# EAGLE design logic (EAGLE 6.5.0)
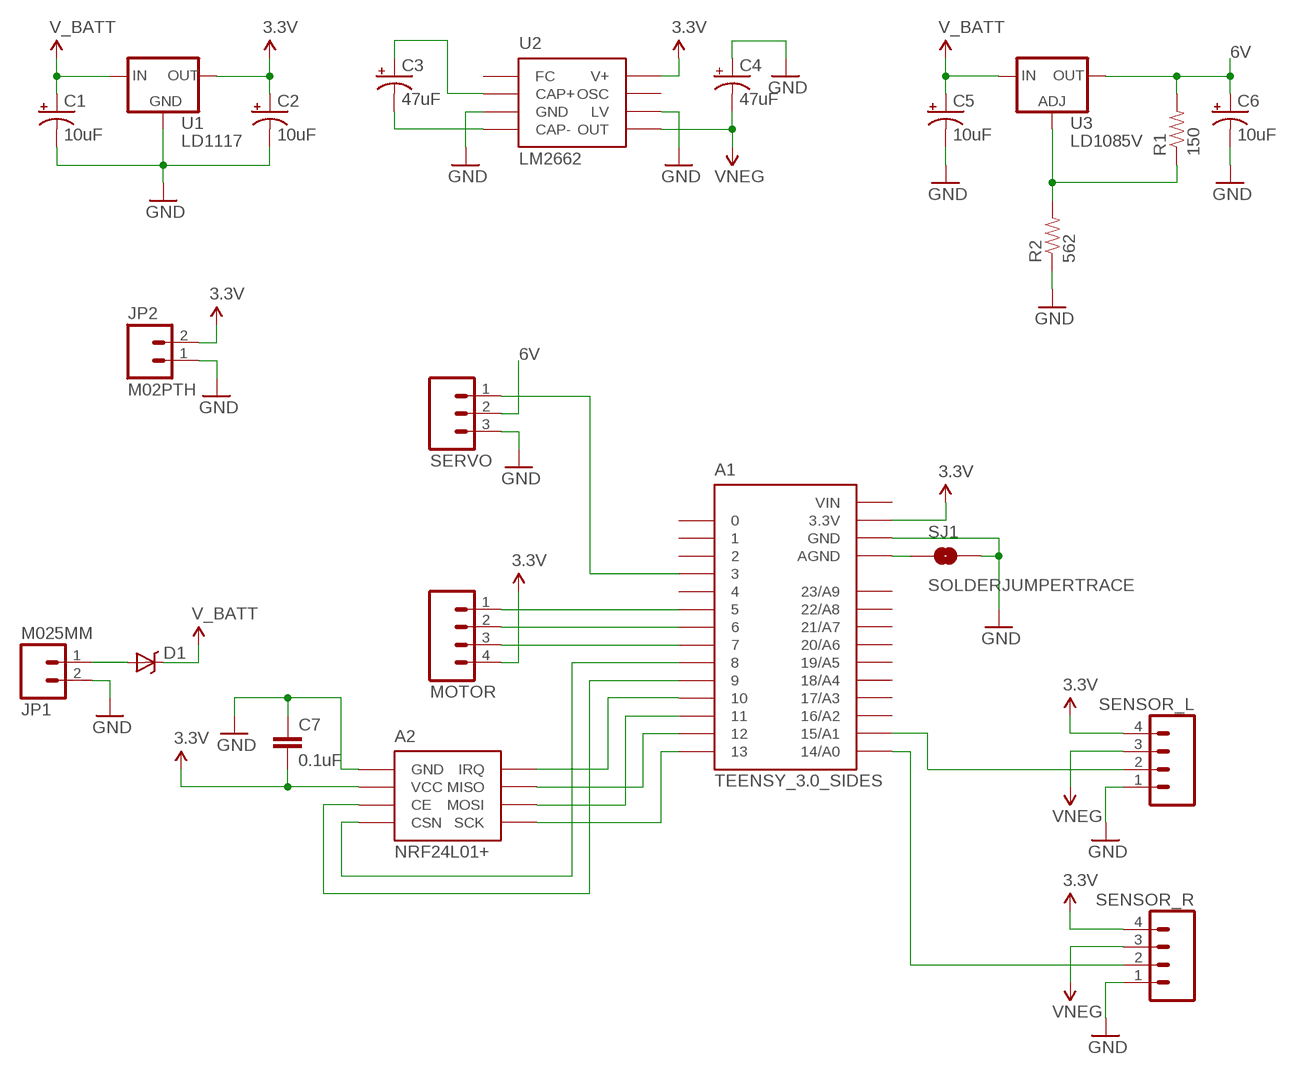
[diagram p0: schematic, sheet 1]

## Parts
A1  TEENSY_3.0_SIDES  [TEENSY_3.0_SIDES]
A2  NRF24L01+  [NRF24L01+]
C1  10uF  CPOL-USE2-4  [E2-4]
C2  10uF  CPOL-USE2-4  [E2-4]
C3  47uF  CAP_POLPTH1  [CPOL-RADIAL-100UF-25V]
C4  47uF  CAP_POLPTH1  [CPOL-RADIAL-100UF-25V]
C5  10uF  CPOL-USE2-4  [E2-4]
C6  10uF  CPOL-USE2-4  [E2-4]
C7  0.1uF  CAP0805  [0805]
D1  DIODE-SCHOTTKY_  [SMA-DIODE]
JP1  M025MM  [SCREWTERMINAL-5MM-2]
JP2  M02PTH  [1X02]
MOTOR  M04POLAR_LOCK  [MOLEX-1X4_LOCK]
R1  150  RESISTOR0805-RES  [0805]
R2  562  RESISTOR0805-RES  [0805]
SENSOR_L  M04POLAR_LOCK  [MOLEX-1X4_LOCK]
SENSOR_R  M04POLAR_LOCK  [MOLEX-1X4_LOCK]
SERVO  M03LOCK_LONGPADS  [1X03_LOCK_LONGPADS]
SJ1  SOLDERJUMPERTRACE  [SJ_2S-TRACE]
U1  LD1117  [SOT-223]
U2  LM2662  [SOIC-8]
U3  LD1085V  LM317TS  [317TS]

## Nets
3.3V: A1.3.3V A2.2(VCC) C2.+ C7.2 JP2.2 MOTOR.4 SENSOR_L.4 SENSOR_R.4 U1.2(OUT) U1.4(OUT) U2.8(V+)
6V: C6.+ R1.2 SERVO.2 U3.2(OUT)
GND: A1.GND A2.1(GND) C1.- C2.- C4.1(+) C5.- C6.- C7.1 JP1.2 JP2.1 R2.1 SENSOR_L.1 SENSOR_R.1 SERVO.3 SJ1.2 U1.1(GND) U2.3(GND) U2.6(LV)
N$1: D1.A JP1.1
N$2: C3.1(+) U2.2(CAP+)
N$3: C3.2(-) U2.4(CAP-)
N$4: R1.1 R2.2 U3.1(ADJ)
N$5: A1.13 A2.5(SCK)
N$6: A1.12 A2.7(MISO)
N$7: A1.11 A2.6(MOSI)
N$8: A1.8 A2.4(CSN)
N$9: A1.10 A2.8(IRQ)
N$10: A1.9 A2.3(CE)
N$11: A1.3 SERVO.1
N$12: A1.AGND SJ1.1
N$13: A1.15/A1 SENSOR_L.2
N$14: A1.14/A0 SENSOR_R.2
N$15: A1.5 MOTOR.1
N$16: A1.6 MOTOR.2
N$17: A1.7 MOTOR.3
V_BATT: C1.+ C5.+ D1.C U1.3(IN) U3.3(IN)
VNEG: C4.2(-) SENSOR_L.3 SENSOR_R.3 U2.5(OUT)
Unconnected: A1.0 A1.1 A1.2 A1.4 A1.16/A2 A1.17/A3 A1.18/A4 A1.19/A5 A1.20/A6 A1.21/A7 A1.22/A8 A1.23/A9 U2.1(FC) U2.7(OSC)

## Power pins joined to a net without a drawn wire
VIN: A1.VIN

## Library data of the parts
A1 = Teensy3.0:TEENSY_3.0_SIDES
A2 = Custom:NRF24L01+: 2.4 GHz Radio Module
C1 C2 C5 C6 = resistor:CPOL-US: POLARIZED CAPACITOR, American symbol
C3 C4 = SparkFun-Capacitors:CAP_POL: Capacitor Polarized These are standard SMD and PTH capacitors. Normally 10uF, 47uF, and 100uF in electrolytic and tantalum varieties. Always verify the external diameter of the through hole cap, it varies with capacity, voltage, and manufacturer. The EIA devices should be standard.
C7 = SparkFun-Capacitors:CAP: Capacitor Standard 0603 ceramic capacitor, and 0.1" leaded capacitor.
D1 = SparkFun-DiscreteSemi:DIODE-SCHOTTKY: Commonly MBRA140.
JP1 JP2 = SparkFun-Connectors:M02: Standard 2-pin 0.1" header. Use with - straight break away headers ( PRT-00116) - right angle break away headers (PRT-00553) - swiss pins (PRT-00743) - machine pins (PRT-00117) - female headers (PRT-00115) Molex polarized connector foot print use with: PRT-08233 with associated crimp pins and housings. 2.54_SCREWTERM for use with PRT-10571. 3.5mm Screw Terminal footprints for PRT-08084 5mm Screw Terminal footprints for use with PRT-08433
MOTOR SENSOR_L SENSOR_R = SparkFun-Connectors:M04: Header 4 Standard 4-pin 0.1" header. Use with straight break away headers (SKU : PRT-00116), right angle break away headers (PRT-00553), swiss pins (PRT-00743), machine pins (PRT-00117), and female headers (PRT-00115). Molex polarized connector foot print use with SKU : PRT-08231 with associated crimp pins and housings. 1MM SMD Version SKU: PRT-10208
R1 R2 = SparkFun-Resistors:RESISTOR: Resistor Basic schematic elements and footprints for 0603, 1206, and PTH resistors.
SERVO = SparkFun-Connectors:M03: Header 3 Standard 3-pin 0.1" header. Use with straight break away headers (SKU : PRT-00116), right angle break away headers (PRT-00553), swiss pins (PRT-00743), machine pins (PRT-00117), and female headers (PRT-00115). Molex polarized connector foot print use with SKU : PRT-08232 with associated crimp pins and housings.
SJ1 = SparkFun-Passives:SOLDERJUMPER: Solder Jumper Standard SMD solder jumper. Used to automate production. Two varients : Normally Open and Normally Closed are the same, but have different paste layers. NC will have a large amount of paste and should jumper during reflow.
U1 = Custom:LD1117: Low-Dropout Voltage Regulator
U2 = Custom:LM2662: Switched Capacitor Voltage Converter
U3 = v-reg:LM317TS: VOLTAGE REGULATOR

## Board
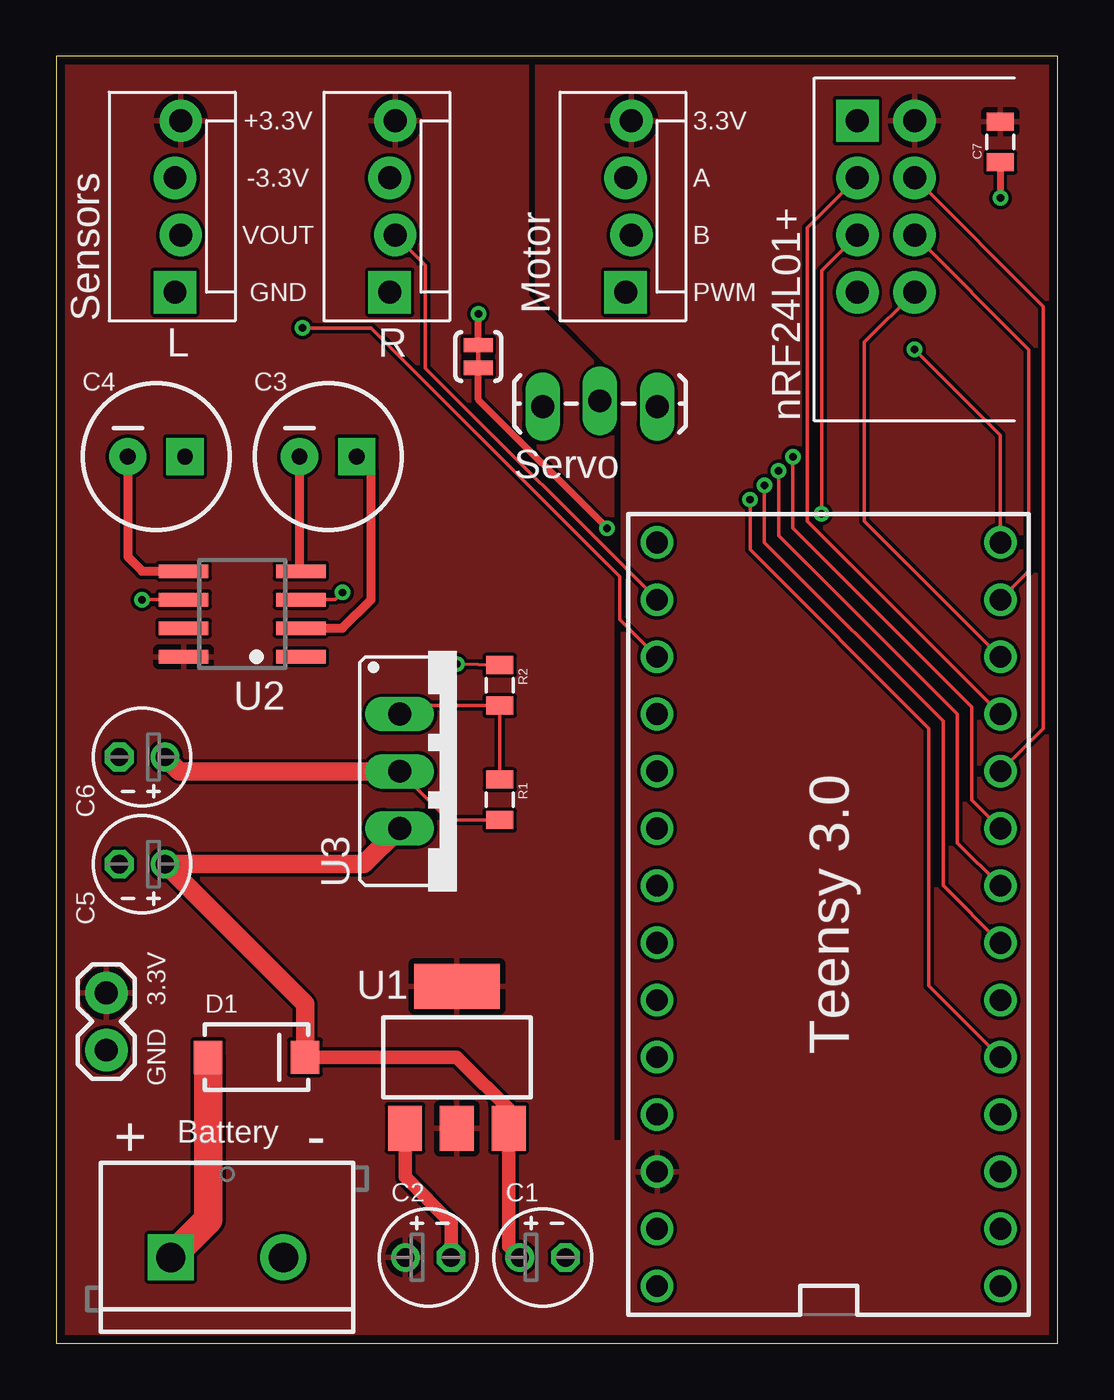
[diagram p1: board, top side]
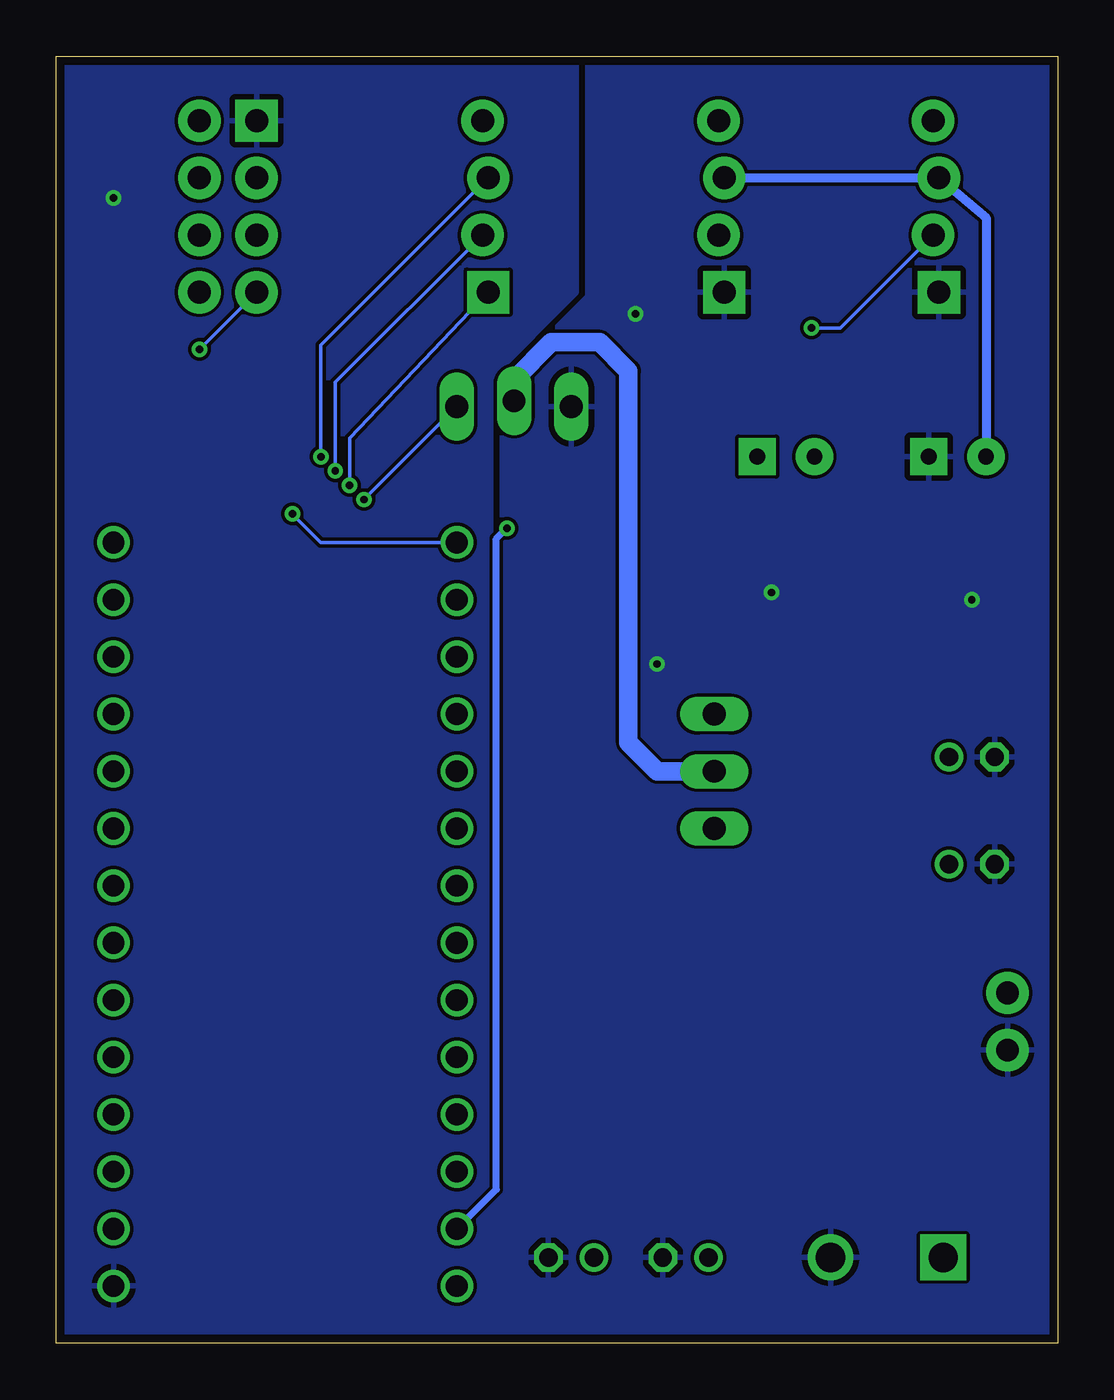
[diagram p2: board, bottom side, seen from below]

Size 44.45 x 57.15 mm. Coordinates in mm from the lower left corner, seen from the top.
Outline: 0,0 44.45,0 44.45,57.15 0,57.15 0,0
Copper layers (1*16): Top 0.0356mm / dielectric 1.5011mm / Bottom 0.0356mm
Design rules "LaenPCBOrder": minimum track width 6mil, minimum drill 13mil, track to track 6mil, track to pad 6mil, pad to pad 6mil, via to via 6mil, smd to smd 6mil, copper to edge 15mil, drill to drill 6mil, minimum pad ring 7mil, minimum via ring 7mil, stop-mask expansion 3mil, vias tented up to drill 0mil, thermal gap 10mil

### Footprints (pad centres in the part's own frame; a part is rotated, then mirrored left to right if it is on the bottom)
TEENSY_3.0_SIDES = drill 0.965: 0 -7.62,13.97; 1 -7.62,11.43; 2 -7.62,8.89; 3 -7.62,6.35; 3.3V 7.62,11.43; 4 -7.62,3.81; 5 -7.62,1.27; 6 -7.62,-1.27; 7 -7.62,-3.81; 8 -7.62,-6.35; 9 -7.62,-8.89; 10 -7.62,-11.43; 11 -7.62,-13.97; 12 -7.62,-16.51; 13 7.62,-16.51; 14/A0 7.62,-13.97; 15/A1 7.62,-11.43; 16/A2 7.62,-8.89; 17/A3 7.62,-6.35; 18/A4 7.62,-3.81; 19/A5 7.62,-1.27; 20/A6 7.62,1.27; 21/A7 7.62,3.81; 22/A8 7.62,6.35; 23/A9 7.62,8.89; AGND 7.62,13.97; GND -7.62,16.51; VIN 7.62,16.51
NRF24L01+ = drill 1.016 pad 1.88 square: 1 -3.81,-1.27 | drill 1.016 pad 1.88: 2 -3.81,1.27; 3 -1.27,-1.27; 4 -1.27,1.27; 5 1.27,-1.27; 6 1.27,1.27; 7 3.81,-1.27; 8 3.81,1.27
E2-4 = drill 0.813 pad 1.27: + -1.016,0 | drill 0.813 pad 1.27 octagon: - 1.016,0
CPOL-RADIAL-100UF-25V = drill 0.7 pad 1.651 square: 1 1.27,0 | drill 0.7 pad 1.651: 2 -1.27,0
0805 = smd 0.8 x 1.2: 1 -0.9,0; 2 0.9,0
SMA-DIODE = smd 1.27 x 1.47: A -2.15,0; C 2.15,0
SCREWTERMINAL-5MM-2 = drill 1.3 pad 2.032 square: 1 0,0 | drill 1.3 pad 2.032: 2 5,0
1X02 = drill 1.016 pad 1.88: 1 0,0; 2 2.54,0
MOLEX-1X4_LOCK = drill 1.016 pad 1.88 square: 1 0,0.127 | drill 1.016 pad 1.88: 2 2.54,-0.127; 3 5.08,0.127; 4 7.62,-0.127
1X03_LOCK_LONGPADS = drill 1.016 long: 1 0,0; 2 2.54,-0.254; 3 5.08,0
SJ_2S-TRACE = smd 0.635 x 1.27: 1 -0.508,0; 2 0.508,0
SOT-223 = smd 1.5 x 2: 1 -2.3,-3.15; 2 0,-3.15; 3 2.3,-3.15 | smd 3.8 x 2: 4 0,3.15
SOIC-8 = smd 0.6 x 2.2: 1 -1.905,-2.6; 2 -0.635,-2.6; 3 0.635,-2.6; 4 1.905,-2.6; 5 1.905,2.6; 6 0.635,2.6; 7 -0.635,2.6; 8 -1.905,2.6
317TS = drill 1.016 long: 1 -2.54,-2.54; 2 0,-2.54; 3 2.54,-2.54

### Placement (x,y rotation side)
A1  34.29,19.05 180 top
A2  36.83,50.48 270 top
C1  21.59,3.81 0 top
C2  16.51,3.81 0 top
C3  12.06,39.37 0 top
C4  4.45,39.37 0 top
C5  3.81,21.27 180 top
C6  3.81,26.04 180 top
C7  41.91,53.34 90 top
D1  8.89,12.7 0 top
JP1  5.08,3.81 0 top
JP2  2.22,13.02 90 top
MOTOR  25.4,46.67 90 top
R1  19.68,24.13 270 top
R2  19.68,29.21 270 top
SENSOR_L  5.4,46.67 90 top
SENSOR_R  14.92,46.67 90 top
SERVO  26.67,41.59 180 top
SJ1  18.73,43.81 90 top
U1  17.78,12.7 0 top
U2  8.26,32.38 90 top
U3  17.78,25.4 270 top

### Tracks (layer width: path | path; a pad name or v marks a point on that pad's centre or on a via)
3.3V
  pour Top: 0,0 44.45,0 44.45,57.15 21.36,57.15 21.36,46.67 25.17,42.86 25.17,8.89 24.66,8.89 24.66,42.67 20.85,46.48 20.85,57.15 0,57.15
6V
  Top 0.152: R1.2 17.41,23.23 U3.2
  Top 0.813: C6.+ 5.46,25.4 U3.2
  Bottom 0.813: U3.2 17.78,25.4 19.05,26.67 19.05,43.18 20.32,44.45 22.48,44.45 24.13,42.8 SERVO.2
GND  (via drill 0.33)
  Top 0.152: U2.3 12.38,33.02 v12.7,33.34 | U2.6 v3.81,33.02 | R2.1 v17.78,30.16
  Top 0.305: C7.1 v41.91,50.85 | SJ1.2 v18.73,45.72
  Top 0.61: U1.1 15.48,7.38 17.53,5.33 C2.-
  pour Bottom: 0,0 44.45,0 44.45,57.15 21.36,57.15 21.36,46.67 25.17,42.86 25.17,8.89 24.66,8.89 24.66,42.67 20.85,46.48 20.85,57.15 0,57.15
N$1
  Top 1.27: JP1.1 6.74,5.47 D1.A
N$2
  Top 0.406: U2.2 12.7,31.75 13.97,33.02 13.97,38.73 C3.1
N$3
  Top 0.406: C3.2 10.79,34.35 U2.4
N$4
  Top 0.152: R1.1 R2.2 15.61,28.31 U3.1
N$5  (via drill 0.33)
  Top 0.152: v33.97,36.83 33.97,47.62 A2.5
  Bottom 0.152: A1.13 32.7,35.56 v33.97,36.83
N$6  (via drill 0.33)
  Top 0.152: A1.12 41.91,40.32 v38.1,44.13
  Bottom 0.152: v38.1,44.13 A2.7
N$7
  Top 0.152: A2.6 43.18,44.13 43.18,34.29 A1.11
N$8
  Top 0.152: A1.8 43.81,27.3 43.81,46.04 A2.4
N$9
  Top 0.152: A1.10 35.88,36.51 35.88,44.45 A2.8
N$10
  Top 0.152: A1.9 33.34,36.51 33.34,49.53 A2.3
N$11  (via drill 0.33)
  Top 0.152: A1.3 38.73,15.88 38.73,27.3 30.8,35.24 v30.8,37.47
  Bottom 0.152: v30.8,37.47 SERVO.1
N$12  (via drill 0.33)
  Top 0.305: v24.45,36.2 18.73,41.91 SJ1.1
  Bottom 0.305: A1.AGND 24.92,6.83 24.92,35.73 v24.45,36.2
N$13  (via drill 0.33)
  Top 0.152: A1.15/A1 25.02,32.13 25.02,34.04 13.97,45.09 v10.92,45.09
  Bottom 0.152: v10.92,45.09 9.65,45.09 SENSOR_L.2
N$14
  Top 0.152: A1.14/A0 16.38,43.31 16.38,47.88 SENSOR_R.2
N$15  (via drill 0.33)
  Top 0.152: A1.5 39.37,20.32 39.37,27.62 31.43,35.56 v31.43,38.1
  Bottom 0.152: MOTOR.1 31.43,40.2 v31.43,38.1
N$16  (via drill 0.33)
  Top 0.152: A1.6 40.01,22.23 40.01,27.94 32.07,35.88 v32.07,38.73
  Bottom 0.152: MOTOR.2 32.07,42.67 v32.07,38.73
N$17  (via drill 0.33)
  Top 0.152: A1.7 40.64,24.13 40.64,28.26 32.7,36.2 v32.7,39.37
  Bottom 0.152: MOTOR.3 32.7,44.32 v32.7,39.37
V_BATT
  Top 0.61: C1.+ 20.08,4.3 U1.3 20.32,9.79 20.32,10.16 17.78,12.7 D1.C
  Top 0.813: D1.C 11.04,15.06 C5.+ 13.65,21.27 U3.3
VNEG
  Top 0.406: C4.2 3.17,34.92 3.81,34.29 U2.5
  Bottom 0.406: SENSOR_R.3 SENSOR_L.3 3.17,49.97 C4.2

### Text on the board
tPlace: +3.3V | 3.3V | -3.3V | A | VOUT | B | GND | PWM | Motor | Sensors | L | R | nRF24L01+ | Servo | Teensy 3.0 | 3.3V | GND | + | Battery | -